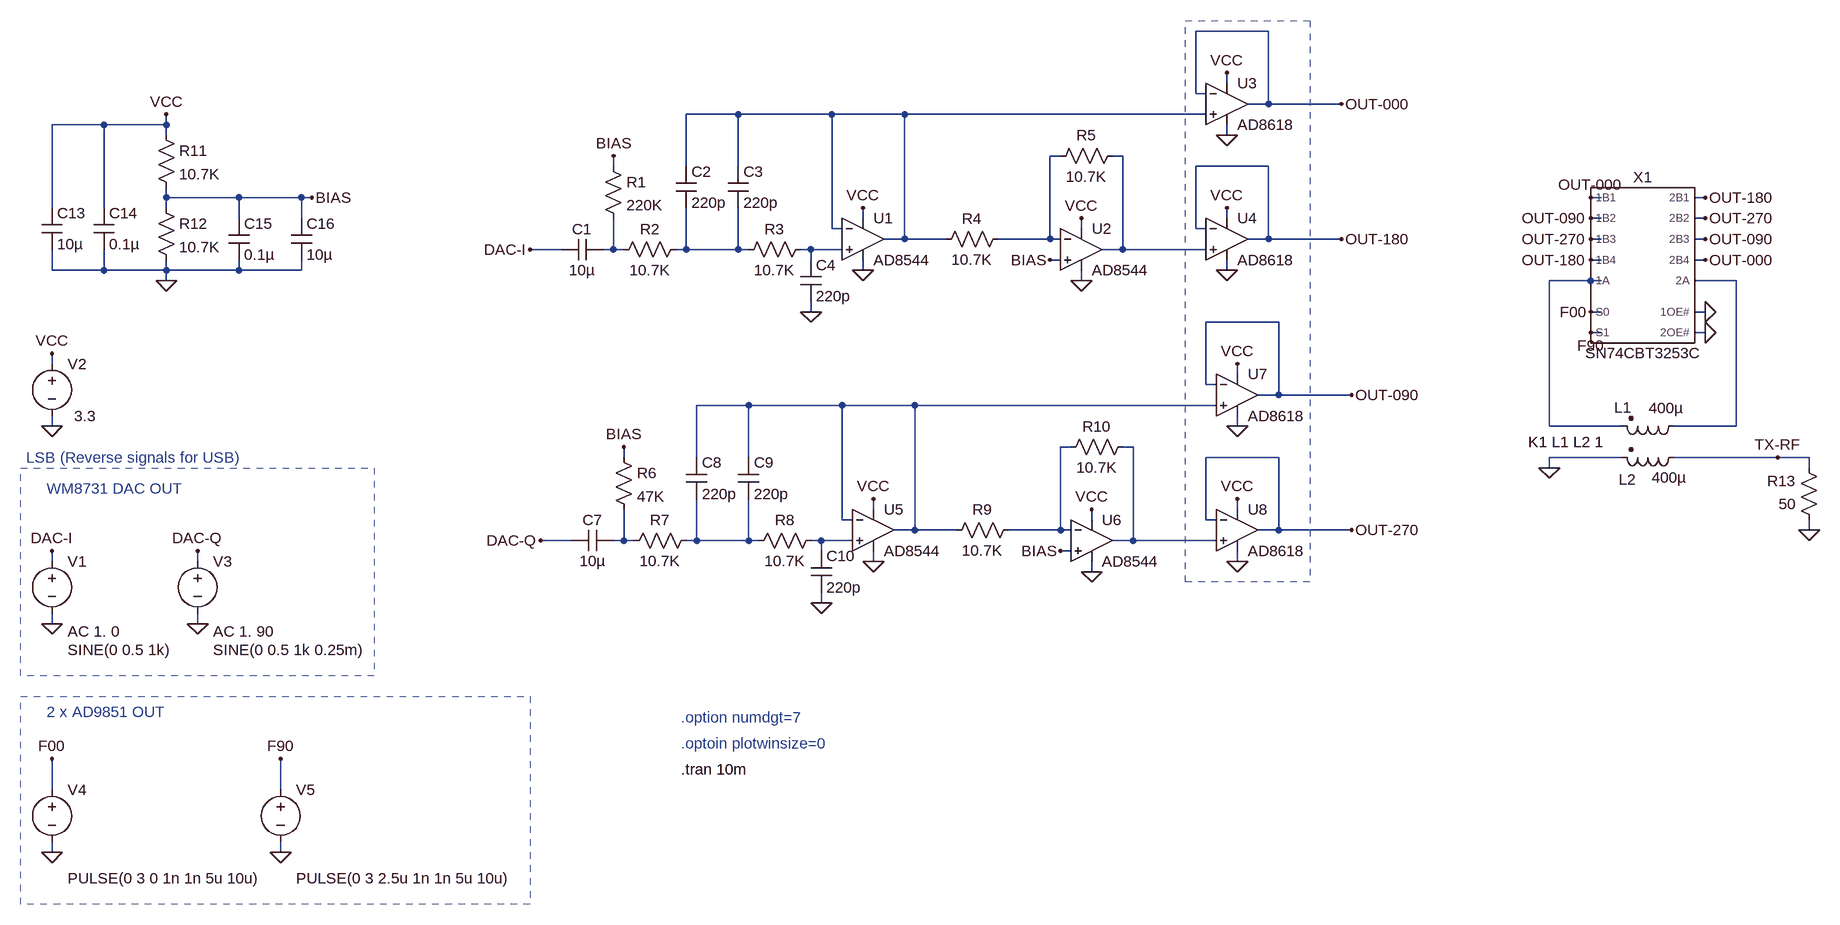
[diagram p0: schematic mixer.asc]
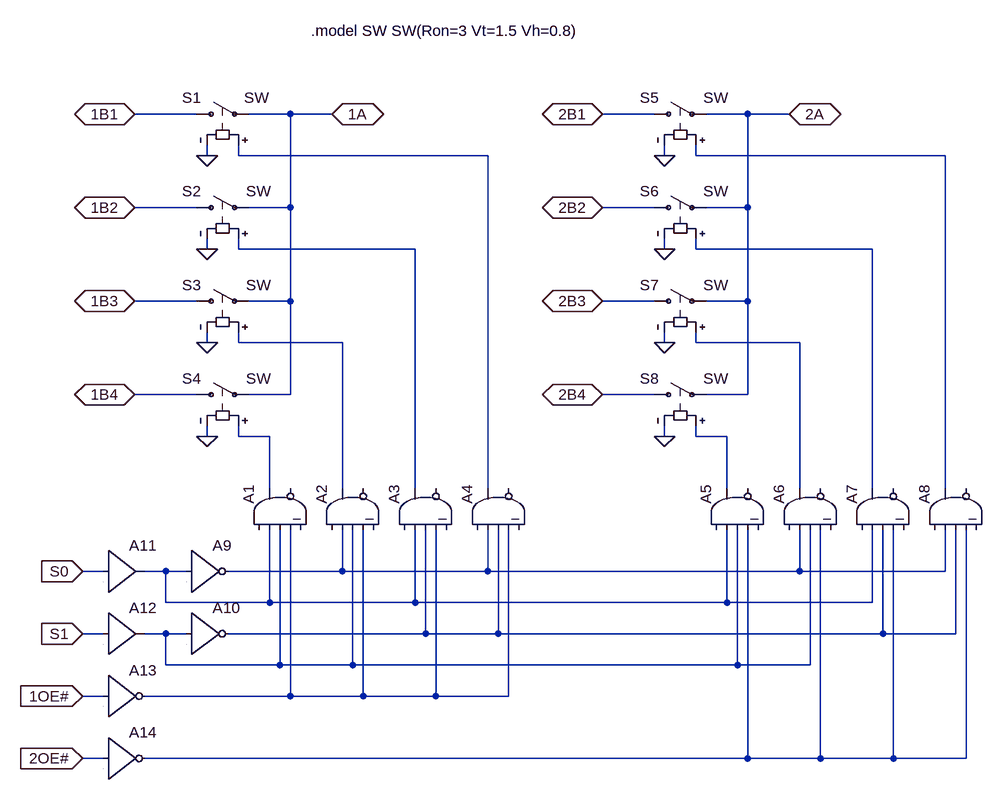
[diagram p1: sub-circuit sn74cbt3253c.asc]
mixer.asc, the LTspice schematic file:
Version 4
SHEET 1 4476 1236
WIRE 1904 -112 1792 -112
WIRE 1840 -32 1840 -48
WIRE 1792 -16 1792 -112
WIRE 1808 -16 1792 -16
WIRE 1904 0 1904 -112
WIRE 1904 0 1872 0
WIRE 2016 0 1904 0
WIRE 1088 16 1008 16
WIRE 1232 16 1088 16
WIRE 1344 16 1232 16
WIRE 1808 16 1344 16
WIRE 112 32 32 32
WIRE 208 32 208 16
WIRE 208 32 112 32
WIRE 208 48 208 32
WIRE 1840 48 1840 32
WIRE 1584 80 1568 80
WIRE 1680 80 1664 80
WIRE 896 96 896 80
WIRE 1008 96 1008 16
WIRE 1088 96 1088 16
WIRE 1904 96 1792 96
WIRE 208 144 208 128
WIRE 320 144 208 144
WIRE 416 144 320 144
WIRE 432 144 416 144
WIRE 2416 144 2400 144
WIRE 2576 144 2560 144
WIRE 32 160 32 32
WIRE 112 160 112 32
WIRE 208 160 208 144
WIRE 320 176 320 144
WIRE 416 176 416 144
WIRE 1280 176 1280 160
WIRE 1840 176 1840 160
WIRE 2416 176 2400 176
WIRE 2576 176 2560 176
WIRE 1232 192 1232 16
WIRE 1248 192 1232 192
WIRE 1616 192 1616 176
WIRE 1792 192 1792 96
WIRE 1808 192 1792 192
WIRE 1344 208 1344 16
WIRE 1344 208 1312 208
WIRE 1408 208 1344 208
WIRE 1568 208 1568 80
WIRE 1568 208 1488 208
WIRE 1584 208 1568 208
WIRE 1904 208 1904 96
WIRE 1904 208 1872 208
WIRE 2016 208 1904 208
WIRE 2416 208 2400 208
WIRE 2576 208 2560 208
WIRE 816 224 768 224
WIRE 896 224 896 176
WIRE 896 224 880 224
WIRE 912 224 896 224
WIRE 1008 224 1008 160
WIRE 1008 224 992 224
WIRE 1088 224 1088 160
WIRE 1088 224 1008 224
WIRE 1104 224 1088 224
WIRE 1200 224 1184 224
WIRE 1248 224 1200 224
WIRE 1680 224 1680 80
WIRE 1680 224 1648 224
WIRE 1808 224 1680 224
WIRE 1200 240 1200 224
WIRE 1584 240 1568 240
WIRE 2416 240 2400 240
WIRE 2576 240 2560 240
WIRE 32 256 32 224
WIRE 112 256 112 224
WIRE 112 256 32 256
WIRE 208 256 208 240
WIRE 208 256 112 256
WIRE 320 256 320 240
WIRE 320 256 208 256
WIRE 416 256 416 240
WIRE 416 256 320 256
WIRE 1280 256 1280 240
WIRE 1840 256 1840 240
WIRE 208 272 208 256
WIRE 1616 272 1616 256
WIRE 2416 272 2336 272
WIRE 2624 272 2560 272
WIRE 1200 320 1200 304
WIRE 2416 320 2400 320
WIRE 2576 320 2560 320
WIRE 1920 336 1808 336
WIRE 2416 352 2400 352
WIRE 2576 352 2560 352
WIRE 32 400 32 384
WIRE 1856 416 1856 400
WIRE 1808 432 1808 336
WIRE 1824 432 1808 432
WIRE 1920 448 1920 336
WIRE 1920 448 1888 448
WIRE 2032 448 1920 448
WIRE 1104 464 1024 464
WIRE 1248 464 1104 464
WIRE 1360 464 1248 464
WIRE 1824 464 1360 464
WIRE 32 496 32 480
WIRE 1856 496 1856 480
WIRE 2336 496 2336 272
WIRE 2448 496 2336 496
WIRE 2624 496 2624 272
WIRE 2624 496 2528 496
WIRE 1600 528 1584 528
WIRE 1696 528 1680 528
WIRE 912 544 912 528
WIRE 1024 544 1024 464
WIRE 1104 544 1104 464
WIRE 1920 544 1808 544
WIRE 2448 544 2336 544
WIRE 2688 544 2528 544
WIRE 2736 544 2688 544
WIRE 2336 560 2336 544
WIRE 2736 560 2736 544
WIRE 1296 624 1296 608
WIRE 1856 624 1856 608
WIRE 1248 640 1248 464
WIRE 1264 640 1248 640
WIRE 1632 640 1632 624
WIRE 1808 640 1808 544
WIRE 1824 640 1808 640
WIRE 1360 656 1360 464
WIRE 1360 656 1328 656
WIRE 1424 656 1360 656
WIRE 1584 656 1584 528
WIRE 1584 656 1504 656
WIRE 1600 656 1584 656
WIRE 1920 656 1920 544
WIRE 1920 656 1888 656
WIRE 2032 656 1920 656
WIRE 2736 656 2736 640
WIRE 832 672 784 672
WIRE 912 672 912 624
WIRE 912 672 896 672
WIRE 928 672 912 672
WIRE 1024 672 1024 608
WIRE 1024 672 1008 672
WIRE 1104 672 1104 608
WIRE 1104 672 1024 672
WIRE 1120 672 1104 672
WIRE 1216 672 1200 672
WIRE 1264 672 1216 672
WIRE 1696 672 1696 528
WIRE 1696 672 1664 672
WIRE 1824 672 1696 672
WIRE 1216 688 1216 672
WIRE 1600 688 1584 688
WIRE 32 704 32 688
WIRE 256 704 256 688
WIRE 1296 704 1296 688
WIRE 1856 704 1856 688
WIRE 1632 720 1632 704
WIRE 1216 768 1216 752
WIRE 32 800 32 784
WIRE 256 800 256 784
WIRE 32 1056 32 1008
WIRE 384 1056 384 1008
WIRE 32 1152 32 1136
WIRE 384 1152 384 1136
FLAG 1280 256 0
FLAG 1280 160 VCC
FLAG 896 80 BIAS
FLAG 208 272 0
FLAG 208 16 VCC
FLAG 432 144 BIAS
FLAG 32 800 0
FLAG 32 688 DAC-I
FLAG 768 224 DAC-I
FLAG 32 496 0
FLAG 32 384 VCC
FLAG 1200 320 0
FLAG 1616 176 VCC
FLAG 1616 272 0
FLAG 1568 240 BIAS
FLAG 2016 0 OUT-000
FLAG 2016 208 OUT-180
FLAG 1840 256 0
FLAG 1840 48 0
FLAG 1840 -48 VCC
FLAG 1840 160 VCC
FLAG 1296 704 0
FLAG 1296 608 VCC
FLAG 784 672 DAC-Q
FLAG 1216 768 0
FLAG 1632 624 VCC
FLAG 1632 720 0
FLAG 1584 688 BIAS
FLAG 2032 448 OUT-090
FLAG 2032 656 OUT-270
FLAG 1856 704 0
FLAG 1856 496 0
FLAG 1856 400 VCC
FLAG 1856 608 VCC
FLAG 256 800 0
FLAG 912 528 BIAS
FLAG 256 688 DAC-Q
FLAG 32 1152 0
FLAG 32 1008 F00
FLAG 384 1152 0
FLAG 384 1008 F90
FLAG 2400 320 F00
FLAG 2400 352 F90
FLAG 2400 144 OUT-000
FLAG 2576 240 OUT-000
FLAG 2400 240 OUT-180
FLAG 2576 144 OUT-180
FLAG 2400 176 OUT-090
FLAG 2576 208 OUT-090
FLAG 2400 208 OUT-270
FLAG 2576 176 OUT-270
FLAG 2576 320 0
FLAG 2576 352 0
FLAG 2336 560 0
FLAG 2736 656 0
FLAG 2688 544 TX-RF
SYMBOL cap 1184 240 R0
SYMATTR InstName C4
SYMATTR Value 220p
SYMBOL res 1200 208 R90
WINDOW 0 0 56 VBottom 2
WINDOW 3 32 56 VTop 2
SYMATTR InstName R3
SYMATTR Value 10.7K
SYMATTR SpiceLine tol=0.1
SYMBOL res 1008 208 R90
WINDOW 0 0 56 VBottom 2
WINDOW 3 32 56 VTop 2
SYMATTR InstName R2
SYMATTR Value 10.7K
SYMATTR SpiceLine tol=0.1
SYMBOL cap 992 96 R0
SYMATTR InstName C2
SYMATTR Value 220p
SYMBOL cap 880 208 R90
WINDOW 0 0 32 VBottom 2
WINDOW 3 32 32 VTop 2
SYMATTR InstName C1
SYMATTR Value 10µ
SYMBOL res 880 80 R0
SYMATTR InstName R1
SYMATTR Value 220K
SYMBOL res 192 32 R0
SYMATTR InstName R11
SYMATTR Value 10.7K
SYMATTR SpiceLine tol=0.1
SYMBOL res 192 144 R0
SYMATTR InstName R12
SYMATTR Value 10.7K
SYMATTR SpiceLine tol=0.1
SYMBOL cap 304 176 R0
SYMATTR InstName C15
SYMATTR Value 0.1µ
SYMBOL cap 400 176 R0
SYMATTR InstName C16
SYMATTR Value 10µ
SYMBOL voltage 32 688 R0
WINDOW 3 24 152 Left 2
WINDOW 123 24 124 Left 2
WINDOW 39 24 44 Left 2
SYMATTR Value SINE(0 0.5 1k)
SYMATTR Value2 AC 1. 0
SYMATTR InstName V1
SYMBOL voltage 32 384 R0
WINDOW 3 34 96 Left 2
WINDOW 123 24 124 Left 2
WINDOW 39 0 0 Left 0
SYMATTR Value 3.3
SYMATTR InstName V2
SYMBOL cap 96 160 R0
SYMATTR InstName C14
SYMATTR Value 0.1µ
SYMBOL cap 16 160 R0
SYMATTR InstName C13
SYMATTR Value 10µ
SYMBOL cap 1072 96 R0
SYMATTR InstName C3
SYMATTR Value 220p
SYMBOL res 1504 192 R90
WINDOW 0 0 56 VBottom 2
WINDOW 3 32 56 VTop 2
SYMATTR InstName R4
SYMATTR Value 10.7K
SYMATTR SpiceLine tol=0.1
SYMBOL res 1680 64 R90
WINDOW 0 0 56 VBottom 2
WINDOW 3 32 56 VTop 2
SYMATTR InstName R5
SYMATTR Value 10.7K
SYMATTR SpiceLine tol=0.1
SYMBOL Opamps\\AD8544 1280 144 R0
SYMATTR InstName U1
SYMBOL Opamps\\AD8544 1616 160 R0
SYMATTR InstName U2
SYMBOL cap 1200 688 R0
SYMATTR InstName C10
SYMATTR Value 220p
SYMBOL res 1216 656 R90
WINDOW 0 0 56 VBottom 2
WINDOW 3 32 56 VTop 2
SYMATTR InstName R8
SYMATTR Value 10.7K
SYMATTR SpiceLine tol=0.1
SYMBOL res 1024 656 R90
WINDOW 0 0 56 VBottom 2
WINDOW 3 32 56 VTop 2
SYMATTR InstName R7
SYMATTR Value 10.7K
SYMATTR SpiceLine tol=0.1
SYMBOL cap 1008 544 R0
SYMATTR InstName C8
SYMATTR Value 220p
SYMBOL cap 896 656 R90
WINDOW 0 0 32 VBottom 2
WINDOW 3 32 32 VTop 2
SYMATTR InstName C7
SYMATTR Value 10µ
SYMBOL res 896 528 R0
SYMATTR InstName R6
SYMATTR Value 47K
SYMBOL cap 1088 544 R0
SYMATTR InstName C9
SYMATTR Value 220p
SYMBOL res 1520 640 R90
WINDOW 0 0 56 VBottom 2
WINDOW 3 32 56 VTop 2
SYMATTR InstName R9
SYMATTR Value 10.7K
SYMATTR SpiceLine tol=0.1
SYMBOL res 1696 512 R90
WINDOW 0 0 56 VBottom 2
WINDOW 3 32 56 VTop 2
SYMATTR InstName R10
SYMATTR Value 10.7K
SYMATTR SpiceLine tol=0.1
SYMBOL Opamps\\AD8544 1296 592 R0
SYMATTR InstName U5
SYMBOL Opamps\\AD8544 1632 608 R0
SYMATTR InstName U6
SYMBOL voltage 256 688 R0
WINDOW 3 24 152 Left 2
WINDOW 123 24 124 Left 2
WINDOW 39 24 44 Left 2
SYMATTR Value SINE(0 0.5 1k 0.25m)
SYMATTR Value2 AC 1. 90
SYMATTR InstName V3
SYMBOL voltage 32 1040 R0
WINDOW 3 24 152 Left 2
WINDOW 123 24 124 Left 2
WINDOW 39 24 44 Left 2
SYMATTR Value PULSE(0 3 0 1n 1n 5u 10u)
SYMATTR InstName V4
SYMBOL voltage 384 1040 R0
WINDOW 3 24 152 Left 2
WINDOW 123 24 124 Left 2
WINDOW 39 24 44 Left 2
SYMATTR Value PULSE(0 3 2.5u 1n 1n 5u 10u)
SYMATTR InstName V5
SYMBOL SN74CBT3253C 2480 256 R0
SYMATTR InstName X1
SYMBOL Opamps\\AD8618 1840 -64 R0
SYMATTR InstName U3
SYMBOL Opamps\\AD8618 1840 144 R0
SYMATTR InstName U4
SYMBOL Opamps\\AD8618 1856 384 R0
SYMATTR InstName U7
SYMBOL Opamps\\AD8618 1856 592 R0
SYMATTR InstName U8
SYMBOL ind2 2544 480 R90
WINDOW 0 -13 81 VRight 2
WINDOW 3 -12 55 VLeft 2
SYMATTR InstName L1
SYMATTR Value 400µ
SYMATTR Type ind
SYMBOL ind2 2544 528 R90
WINDOW 0 50 74 VRight 2
WINDOW 3 47 50 VLeft 2
SYMATTR InstName L2
SYMATTR Value 400µ
SYMATTR Type ind
SYMBOL res 2752 656 R180
WINDOW 0 36 76 Left 2
WINDOW 3 36 40 Left 2
SYMATTR InstName R13
SYMATTR Value 50
SYMATTR SpiceLine tol=0.1
TEXT 1000 1024 Left 2 !.tran 10m
TEXT 24 592 Left 2 ;WM8731 DAC OUT
TEXT 24 936 Left 2 ;2 x AD9851 OUT
TEXT 1000 944 Left 2 ;.option numdgt=7
TEXT 1000 984 Left 2 ;.optoin plotwinsize=0
TEXT -8 544 Left 2 ;LSB (Reverse signals for USB)
TEXT 2304 520 Left 2 !K1 L1 L2 1
RECTANGLE Normal 528 880 -16 560 2
RECTANGLE Normal 1968 736 1776 -128 2
RECTANGLE Normal 768 1232 -16 912 2

sn74cbt3253c.asc, the sub-circuit schematic file:
Version 4
SHEET 1 1616 1176
WIRE 48 112 -48 112
WIRE 192 112 128 112
WIRE 256 112 192 112
WIRE 752 112 672 112
WIRE 896 112 832 112
WIRE 960 112 896 112
WIRE 64 176 64 160
WIRE 112 176 112 160
WIRE 496 176 112 176
WIRE 768 176 768 160
WIRE 816 176 816 160
WIRE 1200 176 816 176
WIRE 48 256 -48 256
WIRE 192 256 192 112
WIRE 192 256 128 256
WIRE 752 256 672 256
WIRE 896 256 896 112
WIRE 896 256 832 256
WIRE 64 320 64 304
WIRE 112 320 112 304
WIRE 384 320 112 320
WIRE 768 320 768 304
WIRE 816 320 816 304
WIRE 1088 320 816 320
WIRE 48 400 -48 400
WIRE 192 400 192 256
WIRE 192 400 128 400
WIRE 752 400 672 400
WIRE 896 400 896 256
WIRE 896 400 832 400
WIRE 64 464 64 448
WIRE 112 464 112 448
WIRE 272 464 112 464
WIRE 768 464 768 448
WIRE 816 464 816 448
WIRE 976 464 816 464
WIRE 48 544 -48 544
WIRE 192 544 192 400
WIRE 192 544 128 544
WIRE 752 544 672 544
WIRE 896 544 896 400
WIRE 896 544 832 544
WIRE 64 608 64 592
WIRE 112 608 112 592
WIRE 160 608 112 608
WIRE 768 608 768 592
WIRE 816 608 816 592
WIRE 864 608 816 608
WIRE 160 688 160 608
WIRE 272 688 272 464
WIRE 384 688 384 320
WIRE 496 688 496 176
WIRE 864 688 864 608
WIRE 976 688 976 464
WIRE 1088 688 1088 320
WIRE 1200 688 1200 176
WIRE -96 816 -128 816
WIRE 0 816 -32 816
WIRE 32 816 0 816
WIRE 272 816 272 752
WIRE 272 816 96 816
WIRE 496 816 496 752
WIRE 496 816 272 816
WIRE 976 816 976 752
WIRE 976 816 496 816
WIRE 1200 816 1200 752
WIRE 1200 816 976 816
WIRE 0 864 0 816
WIRE 160 864 160 752
WIRE 160 864 0 864
WIRE 384 864 384 752
WIRE 384 864 160 864
WIRE 864 864 864 752
WIRE 864 864 384 864
WIRE 1088 864 1088 752
WIRE 1088 864 864 864
WIRE -96 912 -128 912
WIRE 0 912 -32 912
WIRE 32 912 0 912
WIRE 400 912 400 752
WIRE 400 912 96 912
WIRE 512 912 512 752
WIRE 512 912 400 912
WIRE 1104 912 1104 752
WIRE 1104 912 512 912
WIRE 1216 912 1216 752
WIRE 1216 912 1104 912
WIRE 0 960 0 912
WIRE 176 960 176 752
WIRE 176 960 0 960
WIRE 288 960 288 752
WIRE 288 960 176 960
WIRE 880 960 880 752
WIRE 880 960 288 960
WIRE 992 960 992 752
WIRE 992 960 880 960
WIRE -96 1008 -128 1008
WIRE 192 1008 192 752
WIRE 192 1008 -32 1008
WIRE 304 1008 304 752
WIRE 304 1008 192 1008
WIRE 416 1008 416 752
WIRE 416 1008 304 1008
WIRE 528 1008 528 752
WIRE 528 1008 416 1008
WIRE -96 1104 -128 1104
WIRE 896 1104 896 752
WIRE 896 1104 -32 1104
WIRE 1008 1104 1008 752
WIRE 1008 1104 896 1104
WIRE 1120 1104 1120 752
WIRE 1120 1104 1008 1104
WIRE 1232 1104 1232 752
WIRE 1232 1104 1120 1104
FLAG 256 112 1A
IOPIN 256 112 BiDir
FLAG 672 112 2B1
IOPIN 672 112 BiDir
FLAG 672 256 2B2
IOPIN 672 256 BiDir
FLAG 672 400 2B3
IOPIN 672 400 BiDir
FLAG 672 544 2B4
IOPIN 672 544 BiDir
FLAG 960 112 2A
IOPIN 960 112 BiDir
FLAG -128 816 S0
IOPIN -128 816 In
FLAG -128 912 S1
IOPIN -128 912 In
FLAG -128 1008 1OE#
IOPIN -128 1008 In
FLAG -128 1104 2OE#
IOPIN -128 1104 In
FLAG 64 608 0
FLAG 64 176 0
FLAG 64 320 0
FLAG 64 464 0
FLAG 768 176 0
FLAG 768 320 0
FLAG 768 464 0
FLAG 768 608 0
FLAG -48 112 1B1
IOPIN -48 112 BiDir
FLAG -48 256 1B2
IOPIN -48 256 BiDir
FLAG -48 400 1B3
IOPIN -48 400 BiDir
FLAG -48 544 1B4
IOPIN -48 544 BiDir
SYMBOL sw 32 112 R270
WINDOW 0 25 23 VLeft 2
WINDOW 3 25 89 VRight 2
SYMATTR InstName S1
SYMBOL sw 32 256 R270
WINDOW 0 25 23 VLeft 2
WINDOW 3 25 92 VRight 2
SYMATTR InstName S2
SYMBOL sw 32 400 R270
WINDOW 0 25 23 VLeft 2
WINDOW 3 25 92 VRight 2
SYMATTR InstName S3
SYMBOL sw 32 544 R270
WINDOW 0 25 23 VLeft 2
WINDOW 3 25 92 VRight 2
SYMATTR InstName S4
SYMBOL sw 736 112 R270
WINDOW 0 25 23 VLeft 2
WINDOW 3 25 92 VRight 2
SYMATTR InstName S5
SYMBOL sw 736 256 R270
WINDOW 0 25 23 VLeft 2
WINDOW 3 25 92 VRight 2
SYMATTR InstName S6
SYMBOL sw 736 400 R270
WINDOW 0 25 23 VLeft 2
WINDOW 3 25 92 VRight 2
SYMATTR InstName S7
SYMBOL sw 736 544 R270
WINDOW 0 25 23 VLeft 2
WINDOW 3 25 92 VRight 2
SYMATTR InstName S8
SYMBOL Digital\\and 112 720 R270
WINDOW 3 0 0 Invisible 0
SYMATTR InstName A1
SYMATTR Value Vhigh=2.7 Vlow=0.4
SYMBOL Digital\\and 224 720 R270
WINDOW 3 0 0 Invisible 0
SYMATTR InstName A2
SYMATTR Value Vhigh=2.7 Vlow=0.4
SYMBOL Digital\\and 336 720 R270
WINDOW 3 0 0 Invisible 0
SYMATTR InstName A3
SYMATTR Value Vhigh=2.7 Vlow=0.4
SYMBOL Digital\\and 448 720 R270
WINDOW 3 0 0 Invisible 0
SYMATTR InstName A4
SYMATTR Value Vhigh=2.7 Vlow=0.4
SYMBOL Digital\\and 816 720 R270
WINDOW 3 0 0 Invisible 0
SYMATTR InstName A5
SYMATTR Value Vhigh=2.7 Vlow=0.4
SYMBOL Digital\\and 928 720 R270
WINDOW 3 0 0 Invisible 0
SYMATTR InstName A6
SYMATTR Value Vhigh=2.7 Vlow=0.4
SYMBOL Digital\\and 1040 720 R270
WINDOW 3 0 0 Invisible 0
SYMATTR InstName A7
SYMATTR Value Vhigh=2.7 Vlow=0.4
SYMBOL Digital\\and 1152 720 R270
WINDOW 3 0 0 Invisible 0
SYMATTR InstName A8
SYMATTR Value Vhigh=2.7 Vlow=0.4
SYMBOL Digital\\inv 32 752 R0
WINDOW 3 0 0 Invisible 0
SYMATTR InstName A9
SYMATTR Value Vhigh=2.7 Vlow=0.4
SYMBOL Digital\\inv 32 848 R0
WINDOW 3 0 0 Invisible 0
SYMATTR InstName A10
SYMATTR Value Vhigh=2.7 Vlow=0.4
SYMBOL Digital\\buf1 -96 752 R0
WINDOW 3 0 0 Invisible 0
SYMATTR InstName A11
SYMATTR Value Vhigh=2.7 Vlow=0.4
SYMBOL Digital\\buf1 -96 848 R0
WINDOW 3 0 0 Invisible 0
SYMATTR InstName A12
SYMATTR Value Vhigh=2.7 Vlow=0.4
SYMBOL Digital\\inv -96 944 R0
WINDOW 3 0 0 Invisible 0
SYMATTR InstName A13
SYMATTR Value Vhigh=2.7 Vlow=0.4
SYMBOL Digital\\inv -96 1040 R0
WINDOW 3 0 0 Invisible 0
SYMATTR InstName A14
SYMATTR Value Vhigh=2.7 Vlow=0.4
TEXT 224 -16 Left 2 !.model SW SW(Ron=3 Vt=1.5 Vh=0.8)

The netlist it stands for:
* mixer.asc
C4 N006 0 220p
R3 N006 N005 10.7K tol=0.1
R2 N005 N004 10.7K tol=0.1
C2 N001 N005 220p
C1 N004 DAC-I 10µ
R1 BIAS N004 220K
R11 VCC BIAS 10.7K tol=0.1
R12 BIAS 0 10.7K tol=0.1
C15 BIAS 0 0.1µ
C16 BIAS 0 10µ
V1 DAC-I 0 SINE(0 0.5 1k) AC 1. 0
V2 VCC 0 3.3
C14 VCC 0 0.1µ
C13 VCC 0 10µ
C3 N001 N005 220p
R4 N002 N001 10.7K tol=0.1
R5 N003 N002 10.7K tol=0.1
XU1 N006 N001 VCC 0 N001 AD8544  ; pins In+ In- V+ V- OUT
XU2 BIAS N002 VCC 0 N003 AD8544  ; pins In+ In- V+ V- OUT
C10 N014 0 220p
R8 N014 N013 10.7K tol=0.1
R7 N013 N012 10.7K tol=0.1
C8 N009 N013 220p
C7 N012 DAC-Q 10µ
R6 BIAS N012 47K
C9 N009 N013 220p
R9 N010 N009 10.7K tol=0.1
R10 N011 N010 10.7K tol=0.1
XU5 N014 N009 VCC 0 N009 AD8544  ; pins In+ In- V+ V- OUT
XU6 BIAS N010 VCC 0 N011 AD8544  ; pins In+ In- V+ V- OUT
V3 DAC-Q 0 SINE(0 0.5 1k 0.25m) AC 1. 90
V4 F00 0 PULSE(0 3 0 1n 1n 5u 10u)
V5 F90 0 PULSE(0 3 2.5u 1n 1n 5u 10u)
XX1 OUT-000 OUT-090 OUT-270 OUT-180 N007 F00 F90 0 0 N008 OUT-000 OUT-090 OUT-270 OUT-180 sn74cbt3253c params: SN74CBT3253C
XU3 N001 OUT-000 VCC 0 OUT-000 AD8618  ; pins In+ In- V+ V- OUT
XU4 N003 OUT-180 VCC 0 OUT-180 AD8618  ; pins In+ In- V+ V- OUT
XU7 N009 OUT-090 VCC 0 OUT-090 AD8618  ; pins In+ In- V+ V- OUT
XU8 N011 OUT-270 VCC 0 OUT-270 AD8618  ; pins In+ In- V+ V- OUT
L1 N008 N007 400µ
L2 TX-RF 0 400µ
R13 0 TX-RF 50 tol=0.1

* block symbol definitions
.subckt sn74cbt3253c 1B1 1B2 1B3 1B4 1A S0 S1 2OE# 1OE# 2A 2B4 2B3 2B2 2B1
S1 1B1 1A N001 0 SW
S2 1B2 1A N003 0 SW
S3 1B3 1A N005 0 SW
S4 1B4 1A N007 0 SW
S5 2B1 2A N002 0 SW
S6 2B2 2A N004 0 SW
S7 2B3 2A N006 0 SW
S8 2B4 2A N008 0 SW
A1 0 N009 N011 N013 0 0 N007 0 AND Vhigh=2.7 Vlow=0.4
A2 0 N010 N011 N013 0 0 N005 0 AND Vhigh=2.7 Vlow=0.4
A3 0 N009 N012 N013 0 0 N003 0 AND Vhigh=2.7 Vlow=0.4
A4 0 N010 N012 N013 0 0 N001 0 AND Vhigh=2.7 Vlow=0.4
A5 0 N009 N011 N014 0 0 N008 0 AND Vhigh=2.7 Vlow=0.4
A6 0 N010 N011 N014 0 0 N006 0 AND Vhigh=2.7 Vlow=0.4
A7 0 N009 N012 N014 0 0 N004 0 AND Vhigh=2.7 Vlow=0.4
A8 0 N010 N012 N014 0 0 N002 0 AND Vhigh=2.7 Vlow=0.4
A9 N009 0 0 0 0 N010 0 0 BUF Vhigh=2.7 Vlow=0.4
A10 N011 0 0 0 0 N012 0 0 BUF Vhigh=2.7 Vlow=0.4
A11 S0 0 0 0 0 0 N009 0 BUF Vhigh=2.7 Vlow=0.4
A12 S1 0 0 0 0 0 N011 0 BUF Vhigh=2.7 Vlow=0.4
A13 1OE# 0 0 0 0 N013 0 0 BUF Vhigh=2.7 Vlow=0.4
A14 2OE# 0 0 0 0 N014 0 0 BUF Vhigh=2.7 Vlow=0.4
.model SW SW(Ron=3 Vt=1.5 Vh=0.8)
.ends sn74cbt3253c

.tran 10m
* WM8731 DAC OUT
* 2 x AD9851 OUT
* .option numdgt=7
* .optoin plotwinsize=0
* LSB (Reverse signals for USB)
K1 L1 L2 1
.backanno
.end